# EAGLE design Sticker_Alignment_Jig__Sticker (EAGLE 9.6.2)
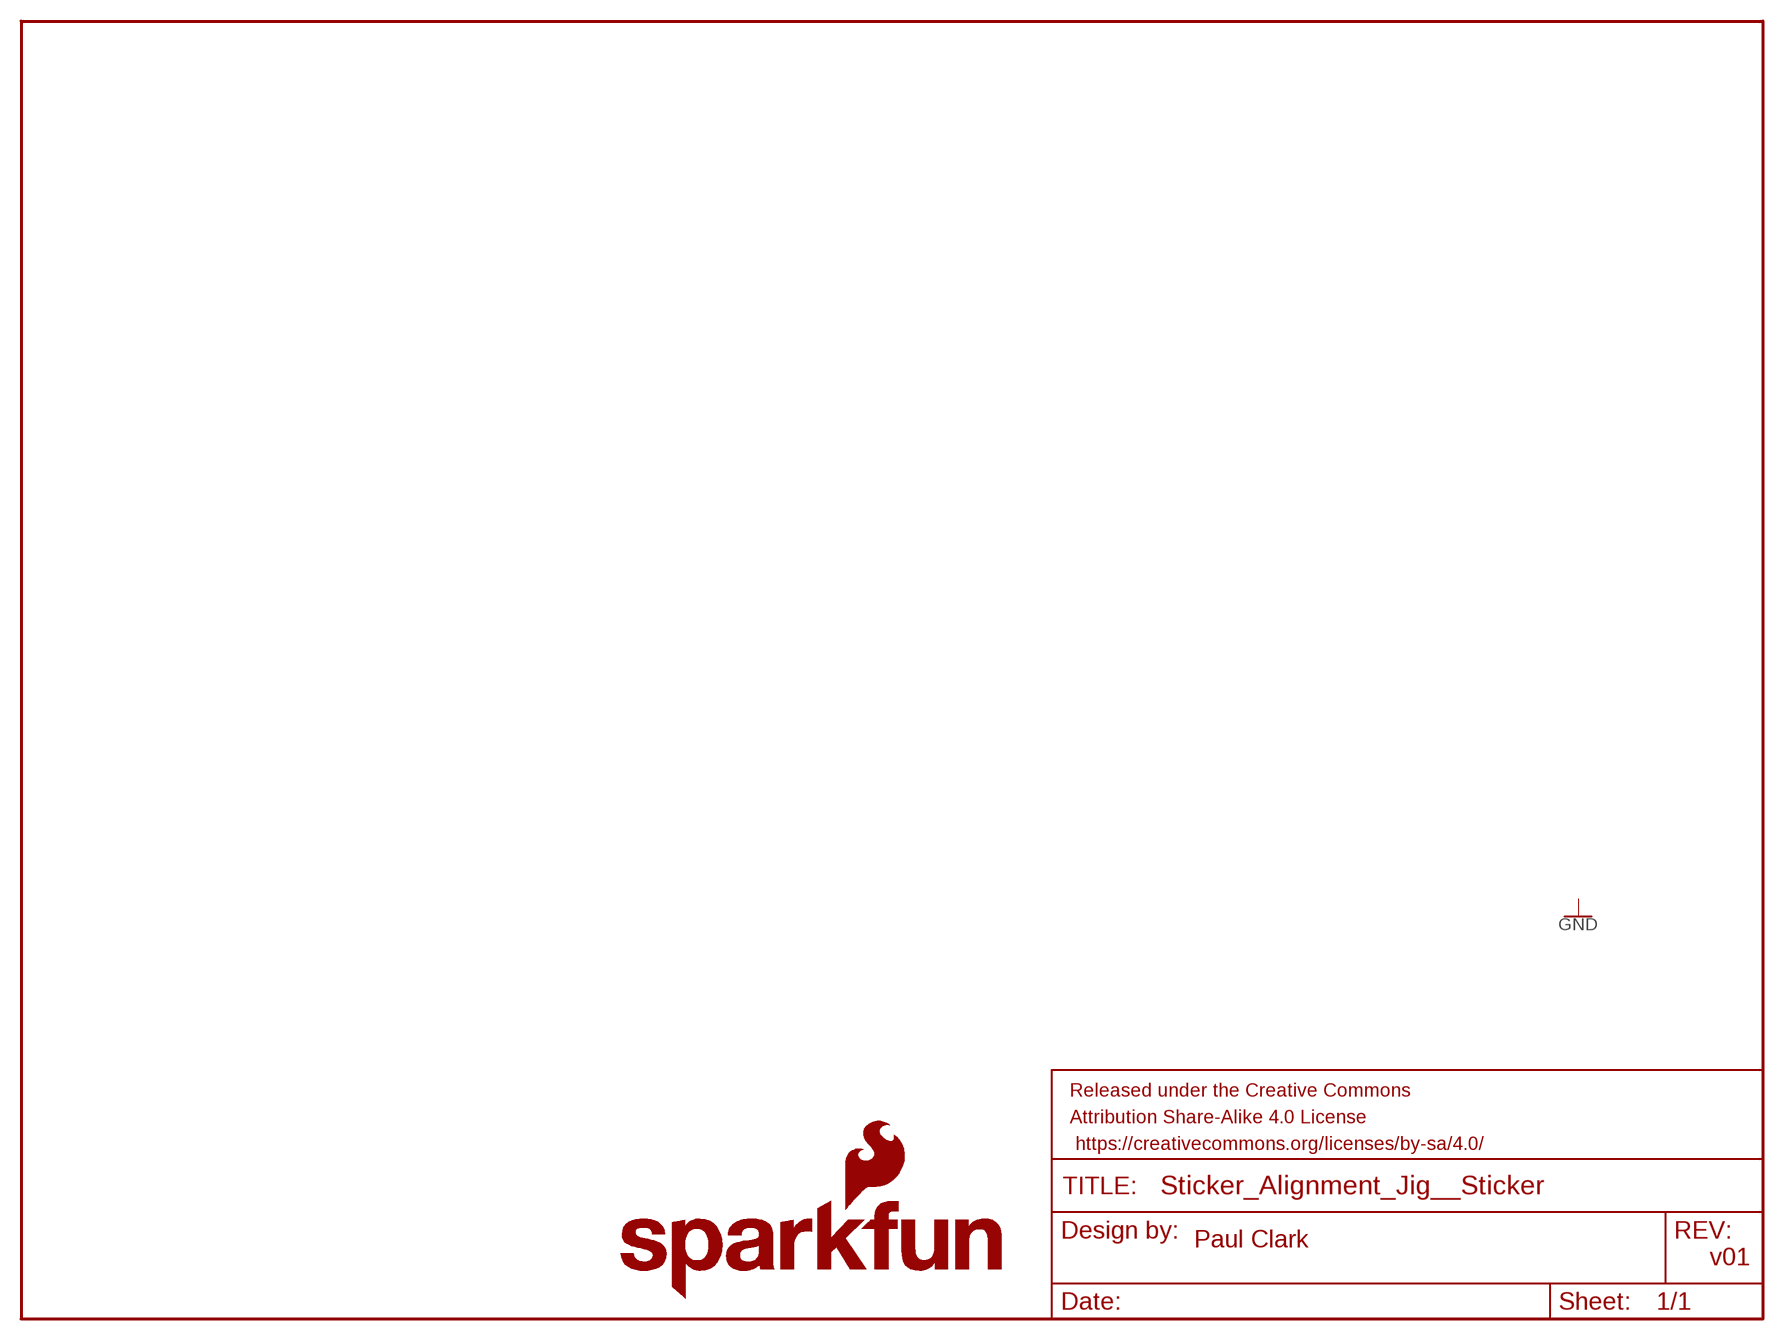
[diagram p0: schematic, sheet 1]

## Parts
FRAME1  FRAME-LETTER  [CREATIVE_COMMONS]
LOGO1  SFE_LOGO_NAME_FLAME.3_INCH  [SFE_LOGO_NAME_FLAME_.3]

## Notes on the sheet
- Paul Clark
- v01

## Library data of the parts
FRAME1 = SparkFun-Aesthetics:FRAME-LETTER: Schematic Frame - Letter Standard 8.5x11 US Letter frame
LOGO1 = SparkFun-Aesthetics:SFE_LOGO_NAME_FLAME: SparkFun Font Logo w/ Flame This is the SparkFun full logo. The logo on the schematic will always be the same size; the package variant is the height of the flame part of the logo. Default layer for the logo on the board is tSilk.

## Board
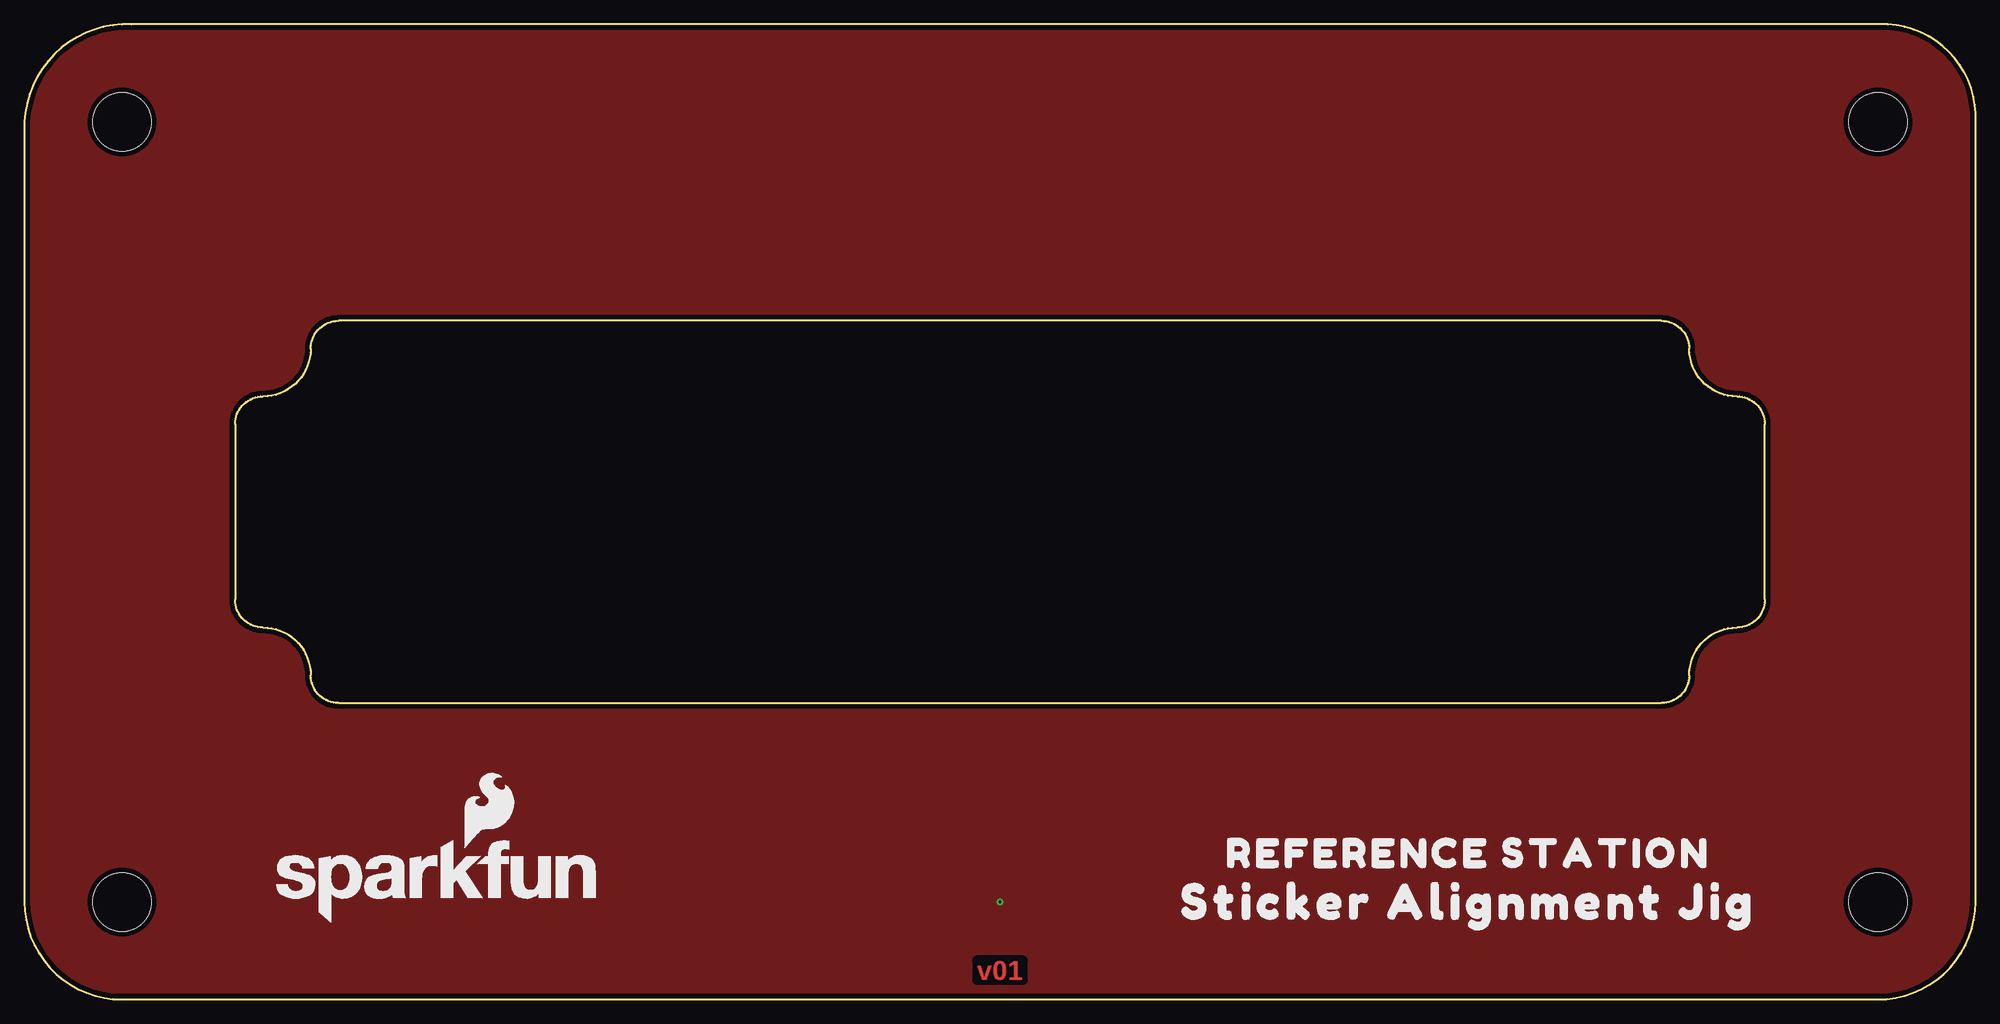
[diagram p1: board, top side]
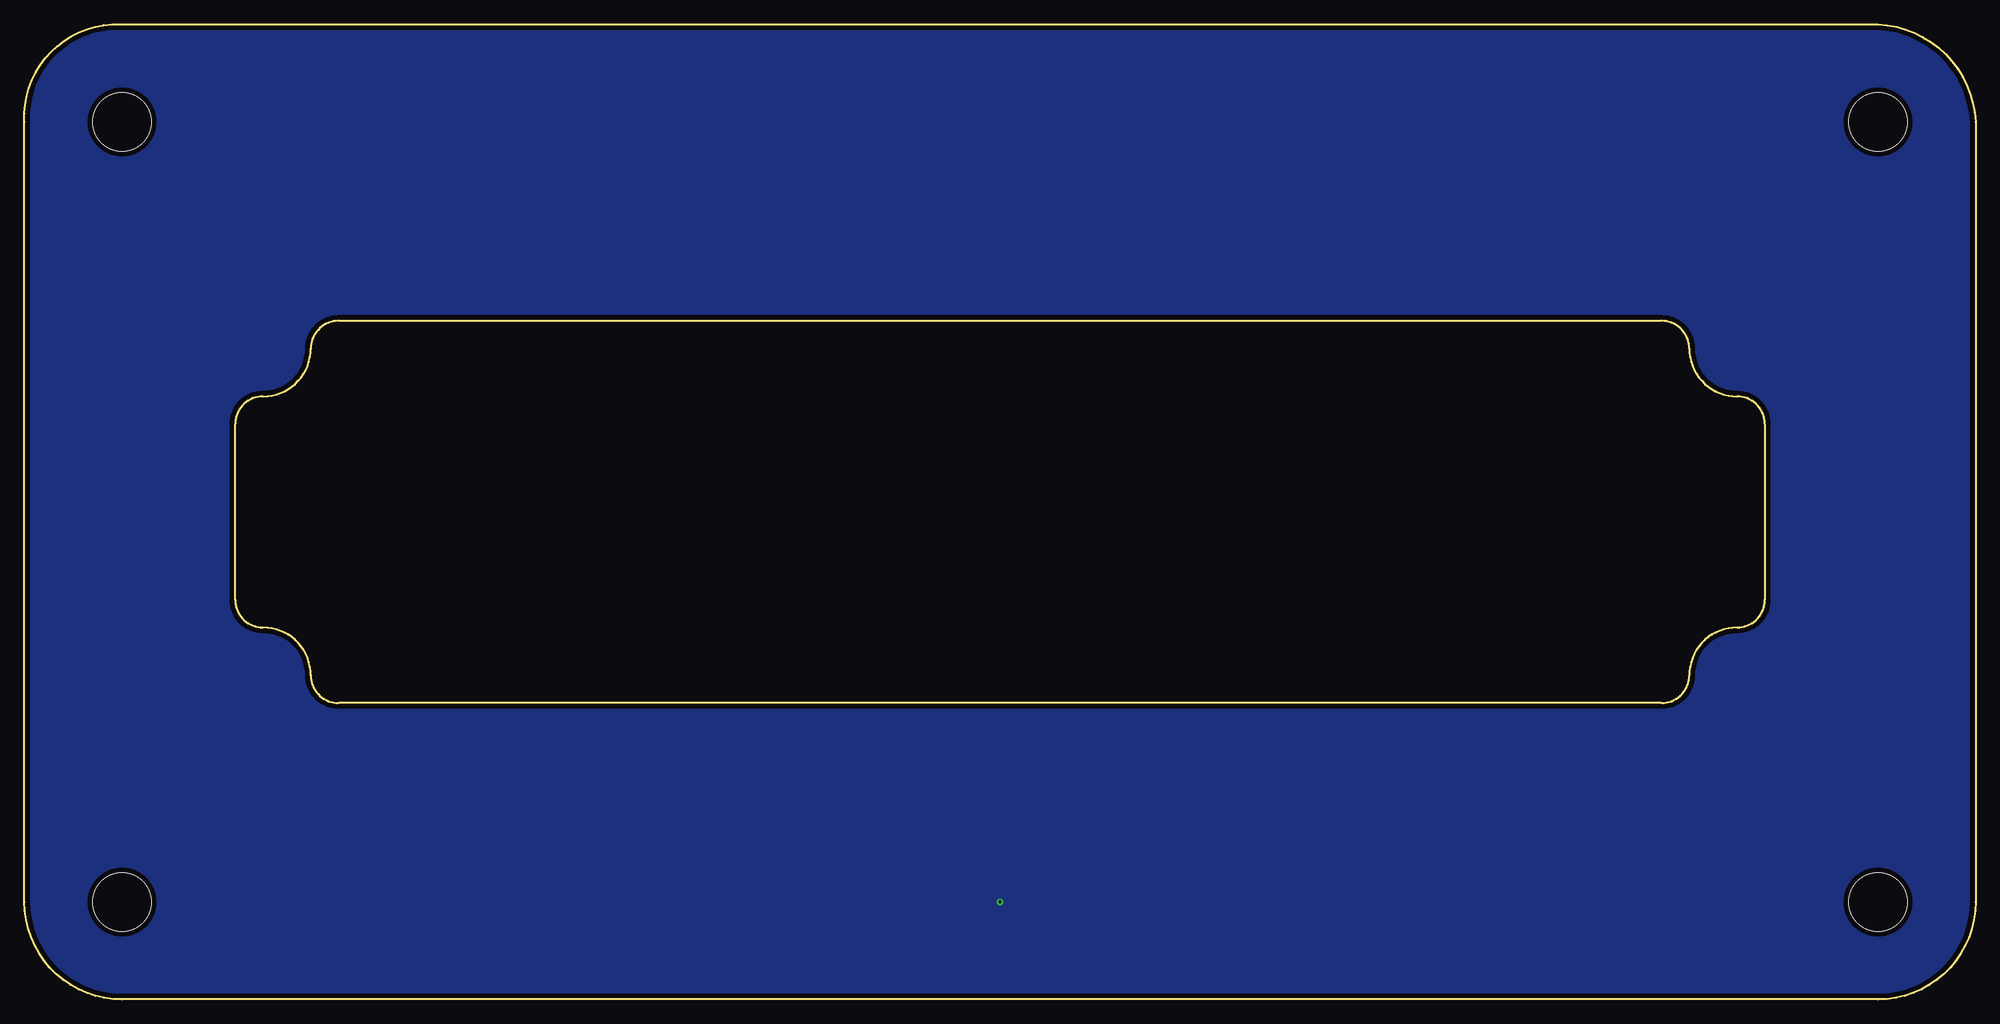
[diagram p2: board, bottom side, seen from below]

Size 200.01 x 100 mm. Coordinates in mm from the lower left corner, seen from the top.
Outline: 0,10 arc90 10,0 190,0 arc90 200,10 200,90 arc90 191,100 11,100 arc90 0,90 0,10
Outline: 21.6,59 21.6,41 arc90 24.45,38.15 arc-90 29.35,33.25 arc90 32.2,30.4 167.8,30.4 arc90 170.65,33.25 arc-90 175.55,38.15 arc90 178.4,41 178.4,59 arc90 175.55,61.85 arc-90 170.65,66.75 arc90 167.8,69.6 32.2,69.6 arc90 29.35,66.75 arc-90 24.45,61.85 arc90 21.6,59
Copper layers (1*16): Top 0.035mm / dielectric 1.5mm / Bottom 0.035mm
Design rules "SparkFun-2-Layer-General-JLCPCB": minimum track width 7mil, minimum drill 0.3mm, track to track 7mil, track to pad 7mil, pad to pad 7mil, via to via 7mil, smd to smd 7mil, copper to edge 7mil, drill to drill 7mil, minimum pad ring 7mil, minimum via ring 7mil, stop-mask expansion 3mil, vias tented up to drill 25mil, thermal gap 10mil
Holes 6 mm at 10,90 190,90 190,10 10,10

### Placement (x,y rotation side)
FRAME1  75,-9 0 top  (outside the outline)
LOGO1  42.15,12.09 0 top
U$1  [REFERENCE_STATION0]  148,15 0 top
U$5  [STICKER_ALIGNMENT_JIG0]  148,10 0 top

### Tracks (layer width: path | path; a pad name or v marks a point on that pad's centre or on a via)
GND  (via drill 0.3)
  other vias: 100,10
  pour Top (isolate 0.5, no thermals): 0,100 200,100 200,0 0,0
  pour Bottom (isolate 0.5, no thermals): 0,100 200,100 200,0 0,0

### Text on the board
Top: v01